# Altium schematic sheet opamp.SchDoc
size A
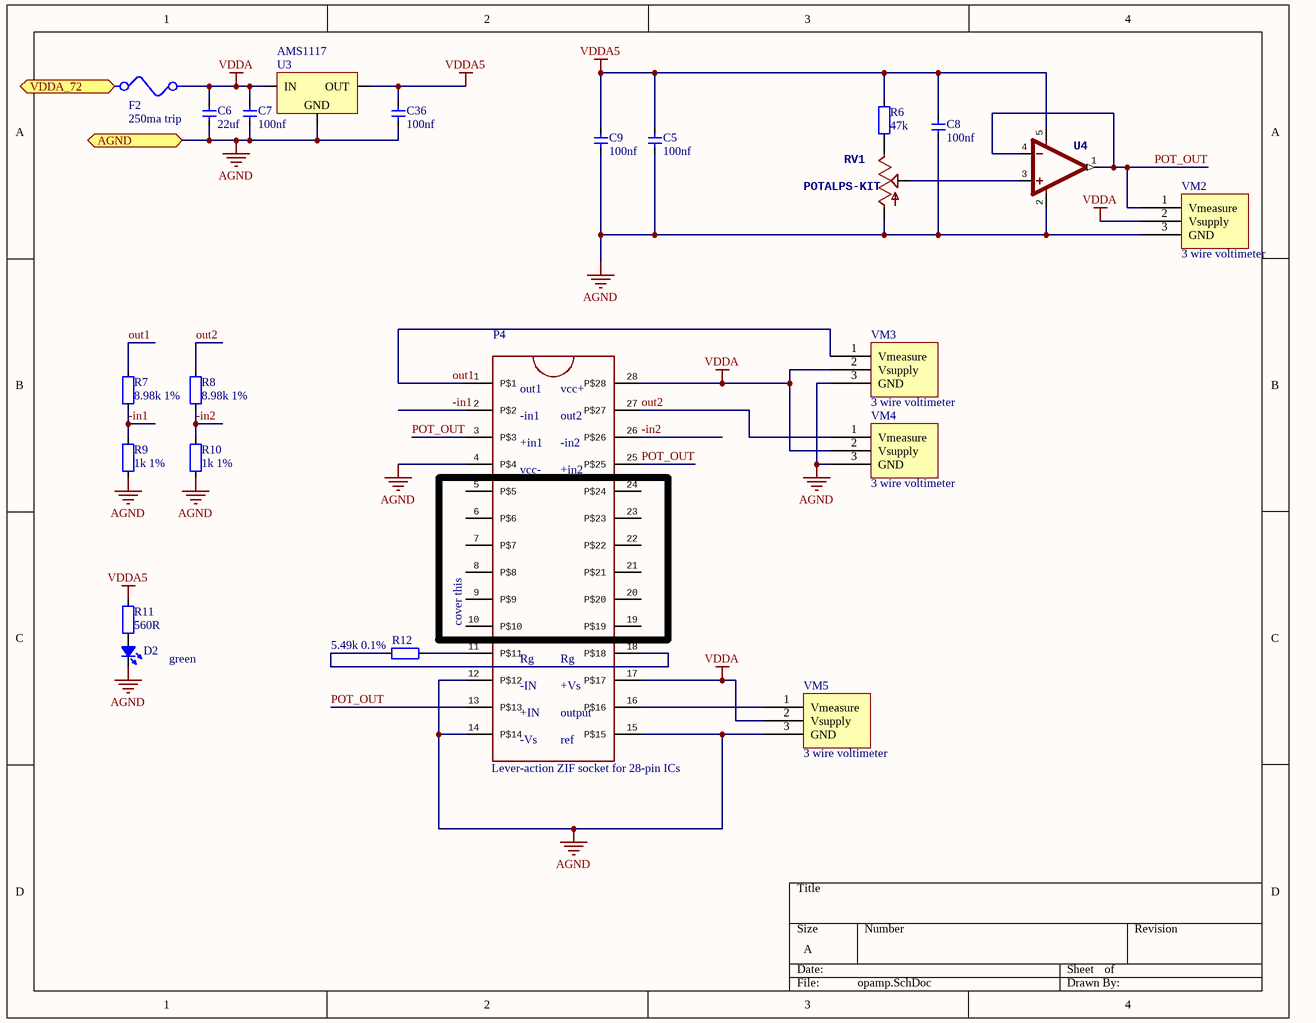
[diagram p0: opamp.SchDoc]

## Parts
C5  value 100nf  [CAP_0805]  (hidden comment: Cap_0805)
C6  value 22uf  [CAP_0805]  (hidden comment: Cap_0805)
C7  value 100nf  [CAP_0805]  (hidden comment: Cap_0805)
C8  value 100nf  [CAP_0805]  (hidden comment: Cap_0805)
C9  value 100nf  [CAP_0805]  (hidden comment: Cap_0805)
C36  value 100nf  [CAP_0805]  (hidden comment: Cap_0805)
D2  LED_0805  [LED_0805_RED]  (value not drawn)
F2  250ma trip  [Multifuse1812]
P4  Lever-action ZIF socket for 28-pin ICs  [DIL28-3-ZIF_SOCKET]
R6  value 47k  [RES_0805]  (hidden comment: Res_0805)
R7  value 8.98k 1%  [RES_0805]  (hidden comment: Res_0805)
R8  value 8.98k 1%  [RES_0805]  (hidden comment: Res_0805)
R9  value 1k 1%  [RES_0805]  (hidden comment: Res_0805)
R10  value 1k 1%  [RES_0805]  (hidden comment: Res_0805)
R11  value 560R  [RES_0805]  (hidden comment: Res_0805)
R12  value 5.49k 0.1%  [RES_0805]  (hidden comment: Res_0805)
RV1  POTALPS-KIT  [Bourns-slimline-axialbracket]
U3  AMS1117  [SOT223-3-CONNECTEDTAB]
U4  Rail to rail OpAmp with 10MHz GBP  [SOT23-5]  (value not drawn)
VM2  3 wire voltimeter  [led_meter_0.36]
VM3  3 wire voltimeter  [led_meter_0.36]
VM4  3 wire voltimeter  [led_meter_0.36]
VM5  3 wire voltimeter  [led_meter_0.36]

## Ports
AGND, VDDA_72

## Nets
AGND: C5.1 C6.1 C7.1 C8.2 C9.1 C36.1 D2.2(K) P4.4(P$4) P4.12(P$12) P4.14(P$14) P4.15(P$15) R9.1 R10.1 RV1.P$3(A) U3.1(GND) U4.2(V-) VM2.3(GND) VM3.3(GND) VM4.3(GND) VM5.3(GND) ; port AGND
VDDA: C6.2 C7.2 F2.2 P4.17(P$17) P4.28(P$28) U3.3(IN) VM2.2(Vsupply) VM3.2(Vsupply) VM4.2(Vsupply) VM5.2(Vsupply)
VDDA5: C5.2 C8.1 C9.2 C36.2 R6.1 R11.2 U3.2(OUT) U4.5(V+)
-in1: P4.2(P$2) R7.2 R9.2
-in2: P4.26(P$26) R8.2 R10.2
out1: P4.1(P$1) R7.1 VM3.1(Vmeasure)
out2: P4.27(P$27) R8.1 VM4.1(Vmeasure)
POT_OUT: P4.3(P$3) P4.13(P$13) P4.25(P$25) U4.1(OUT) U4.4(-IN) VM2.1(Vmeasure)
VDDA_72: F2.1 ; port VDDA_72
NetD2_1: D2.1(A) R11.1
NetP4_11: P4.11(P$11) R12.2
NetP4_16: P4.16(P$16) VM5.1(Vmeasure)
NetP4_18: P4.18(P$18) R12.1
NetR6_2: R6.2 RV1.P$1(E)
NetRV1_P$2: RV1.P$2(S) U4.3(+IN)

Not connected (* = marked no-connect by the designer): P4 5(P$5) 6(P$6) 7(P$7) 8(P$8) 9(P$9) 10(P$10) 19(P$19) 20(P$20) 21(P$21) 22(P$22) 23(P$23) 24(P$24)

## Notes on the sheet
- (near P4) out1
- (near P4) -in1
- (near P4) out2
- (near P4) vcc+
- (near P4) +in1
- (near P4) vcc-
- (near P4) -in2
- (near P4) +in2
- cover this
- green
- (near P4) -IN
- (near P4) Rg
- (near P4) +Vs
- (near P4) +IN
- (near P4) -Vs
- (near P4) output
- (near P4) ref

## Library data of the parts
C5-C9 C36 = Cap_0805: Capacitor
D2 = LED_0805: LED
F2 = Multifuse: RO ZEK MULTI 500MA SMD 1812 MF-MSMF050-2 BOURNS; ID: Library_FUSE-0001; Faber ItemCode: 35502800; Info: MULTIFUSE, SMD, 0.5A; Value: 0.5A; Mfg: BOURNS; Mfg code: MF-MSMF050-2
P4 = ZIFSOCKET-28-3ZIFFSOCKET-28-3
R6-R12 = Res_0805: Resistor
RV1 = POTALPS-KIT: pin to pad: P$1>1 P$2>2 P$3>3; PROD_ID: RES-09177
U3 = AMS1117: Power
U4 = MCP6291T-E/OT: PROD_ID: IC-11991
VM2-VM5 = Voltmeter_LED_3wire